# Altium schematic sheet mcu.SchDoc
size A4; SheetNumber: 1; SheetTotal: 4
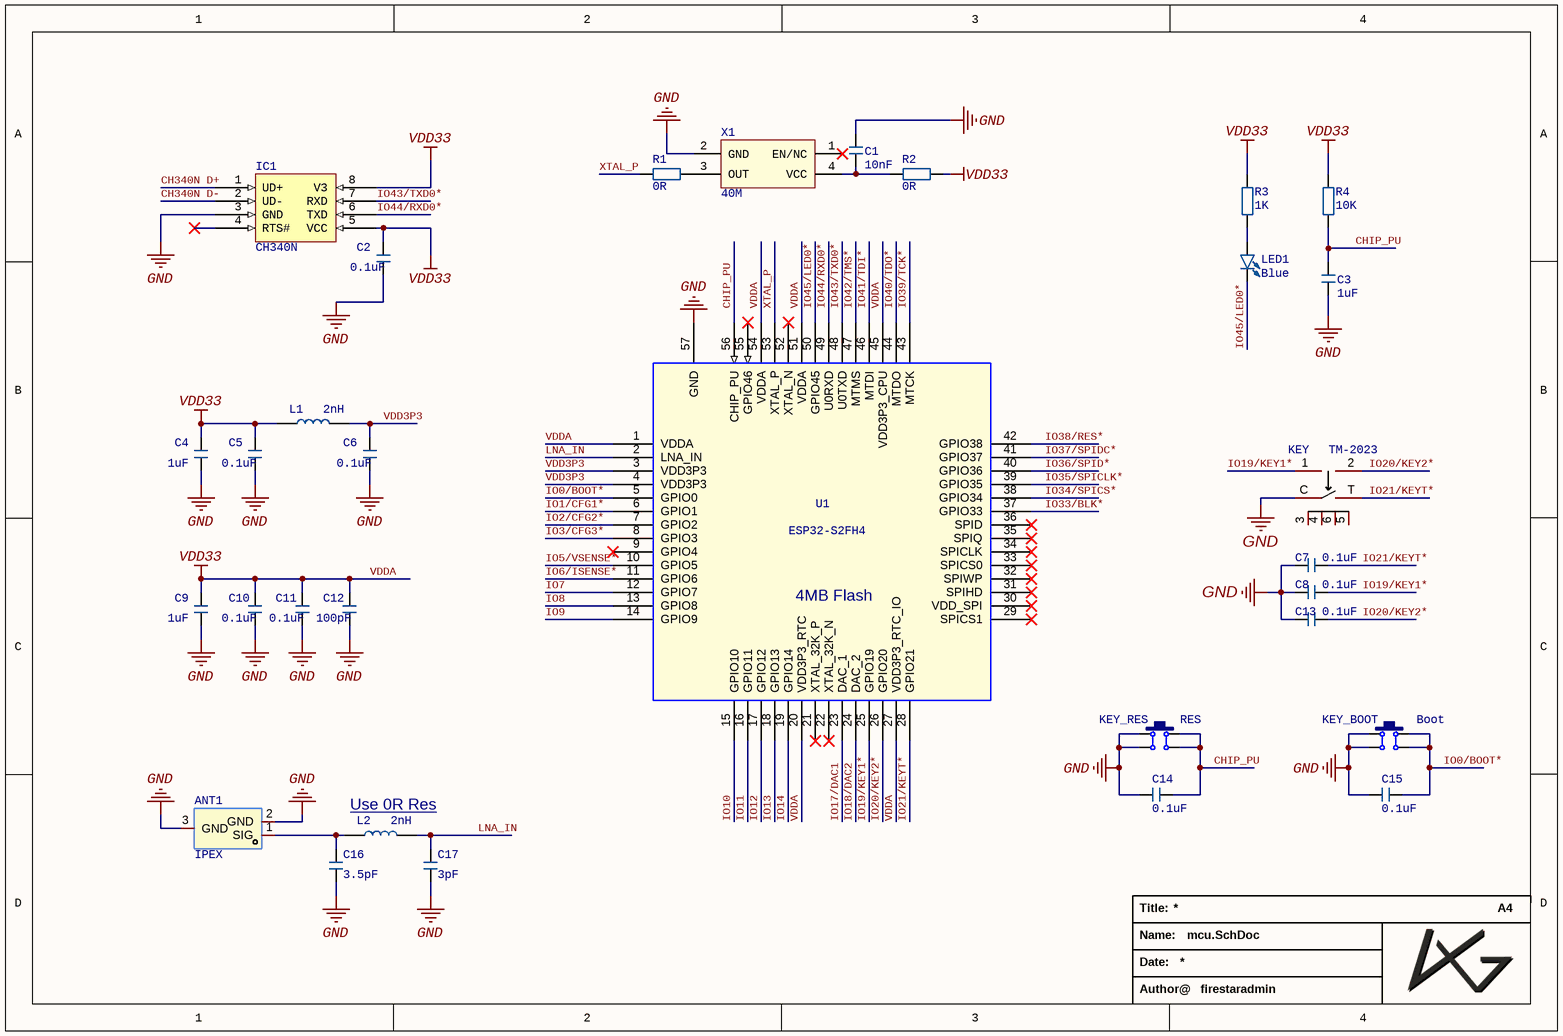
[diagram p0: mcu.SchDoc]

## Parts
ANT1  IPEX  [IPEX-3Pin]
C1  10nF  [C 0603_L]
C2  0.1uF  [C 0603_L]
C3  1uF  [C 0603_L]
C4  1uF  [C 0603_L]
C5  0.1uF  [C 0603_L]
C6  0.1uF  [C 0603_L]
C7  0.1uF  [C 0603_L]
C8  0.1uF  [C 0603_L]
C9  1uF  [C 0603_L]
C10  0.1uF  [C 0603_L]
C11  0.1uF  [C 0603_L]
C12  100pF  [C 0603_L]
C13  0.1uF  [C 0603_L]
C14  0.1uF  [C 0603_L]
C15  0.1uF  [C 0603_L]
C16  3.5pF  [C 0603_L]
C17  3pF  [C 0603_L]
IC1  CH340N  [SOP8_N]
KEY  TM-2023  [TM-2023]
KEY_BOOT  Boot  [TSMD-3*4*2.5]
KEY_RES  RES  [TSMD-3*4*2.5]
L1  2nH  [L 0603-L]
L2  2nH  [L 0603-L]
LED1  Blue  [LED 0603B]
R1  0R  [R 0603_L]
R2  0R  [R 0603_L]
R3  1K  [R 0603_L]
R4  10K  [R 0603_L]
U1  ESP32-S2FH4  [QFN-56_L7.0-W7.0-P0.40-TL-EP4.0]
X1  40M  [OSC 3225-4P]

## Nets
GND: ANT1.2(GND) ANT1.3(GND) C1.2 C2.1 C3.2 C4.1 C5.1 C6.1 C7.1 C8.1 C9.1 C10.1 C11.1 C12.1 C13.1 C14.1 C15.1 C16.1 C17.1 IC1.3(GND) KEY.C KEY_BOOT.1 KEY_BOOT.2 KEY_RES.1 KEY_RES.2 U1.57(GND) X1.2(GND)
VDDA: C2.2 C4.2 C5.2 C9.2 C10.2 C11.2 C12.2 IC1.5(VCC) IC1.8(V3) L1.1 R2.2 R3.2 R4.2 U1.1(VDDA) U1.20(VDD3P3_RTC) U1.27(VDD3P3_RTC_IO) U1.45(VDD3P3_CPU) U1.51(VDDA) U1.54(VDDA)  [also labelled VDD33]
CH340N D+: IC1.1(UD+)
CH340N D-: IC1.2(UD-)
CHIP_PU: C3.1 C14.2 KEY_RES.3 KEY_RES.4 R4.1 U1.56(CHIP_PU)
IO0/BOOT*: C15.2 KEY_BOOT.3 KEY_BOOT.4 U1.5(GPIO0)
IO1/CFG1*: U1.6(GPIO1)
IO2/CFG2*: U1.7(GPIO2)
IO3/CFG3*: U1.8(GPIO3)
IO5/VSENSE*: U1.10(GPIO5)
IO6/ISENSE*: U1.11(GPIO6)
IO7: U1.12(GPIO7)
IO8: U1.13(GPIO8)
IO9: U1.14(GPIO9)
IO10: U1.15(GPIO10)
IO11: U1.16(GPIO11)
IO12: U1.17(GPIO12)
IO13: U1.18(GPIO13)
IO14: U1.19(GPIO14)
IO17/DAC1: U1.23(DAC_1)
IO18/DAC2: U1.24(DAC_2)
IO19/KEY1*: C8.2 KEY.1 U1.25(GPIO19)
IO20/KEY2*: C13.2 KEY.2 U1.26(GPIO20)
IO21/KEYT*: C7.2 KEY.T U1.28(GPIO21)
IO33/BLK*: U1.37(GPIO33)
IO34/SPICS*: U1.38(GPIO34)
IO35/SPICLK*: U1.39(GPIO35)
IO36/SPID*: U1.40(GPIO36)
IO37/SPIDC*: U1.41(GPIO37)
IO38/RES*: U1.42(GPIO38)
IO39/TCK*: U1.43(MTCK)
IO40/TDO*: U1.44(MTDO)
IO41/TDI*: U1.46(MTDI)
IO42/TMS*: U1.47(MTMS)
IO43/TXD0*: IC1.7(RXD) U1.48(U0TXD)
IO44/RXD0*: IC1.6(TXD) U1.49(U0RXD)
IO45/LED0*: LED1.2(K) U1.50(GPIO45)
LNA_IN: C17.2 L2.2 U1.2(LNA_IN)
VDD3P3: C6.2 L1.2 U1.3(VDD3P3) U1.4(VDD3P3)
XTAL_P: R1.1 U1.53(XTAL_P)
NetANT1_1: ANT1.1(SIG) C16.2 L2.1
NetC1_1: C1.1 R2.1 X1.4(VCC)
NetLED1_1: LED1.1(A) R3.1
NetR1_2: R1.2 X1.3(OUT)

Not connected (* = marked no-connect by the designer): IC1 4(RTS#)*; KEY 3 4 5 6; U1 9(GPIO4)* 21(XTAL_32K_P)* 22(XTAL_32K_N)* 29(SPICS1)* 30(VDD_SPI)* 31(SPIHD)* 32(SPIWP)* 33(SPICS0)* 34(SPICLK)* 35(SPIQ)* 36(SPID)* 52(XTAL_N)* 55(GPIO46)*; X1 1(EN/NC)*

## Notes on the sheet
- (near U1) 4MB Flash
- (near L2) Use 0R Res
- Title:
- A4
- Name:
- Date:
- Author@
- firestaradmin

## Library data of the parts
ANT1 = IPEX: IPEX 天线座子
C1-C17 = C: 无极性贴片电容; 版权归属: 源创客; BOM名称: 无极性贴片电容; 学习资源: www.ooocke.com
IC1 = CH340N: USB 转串口芯片 CH330/CH340N
KEY = TM-2023: 三角拨轮开关
KEY_BOOT KEY_RES = TS-3x4x2.5mm-4pin: TS-3x4x2.5mm-4pin 轻触按键
L1 L2 = L: 小功率贴片电感; 版权归属: 源创客; BOM名称: 小功率贴片电感; 学习资源: www.ooocke.com
LED1 = LED-SMD: 贴片LED; 版权归属: 源创客; BOM名称: 贴片LED; 学习资源: www.ooocke.com
R1-R4 = R: 贴片电阻; 版权归属: 源创客; BOM名称: 贴片电阻; 学习资源: www.ooocke.com
U1 = ESP32-S2FH4: 单核 32 位 LX7 微处理器的 SoC, 240Mhz , 4MB Flash
X1 = XTAL-ACT-4P: 4脚有源晶振; 版权归属: 源创客; BOM名称: 4脚有源晶振; 学习资源: www.ooocke.com